# Altium schematic sheet JTAG_Connector.SchDoc
size A4; Author: Nguyễn Hữu Thắng; DrawnBy: Nguyễn Hữu Thắng; SheetNumber: 27; SheetTotal: 36
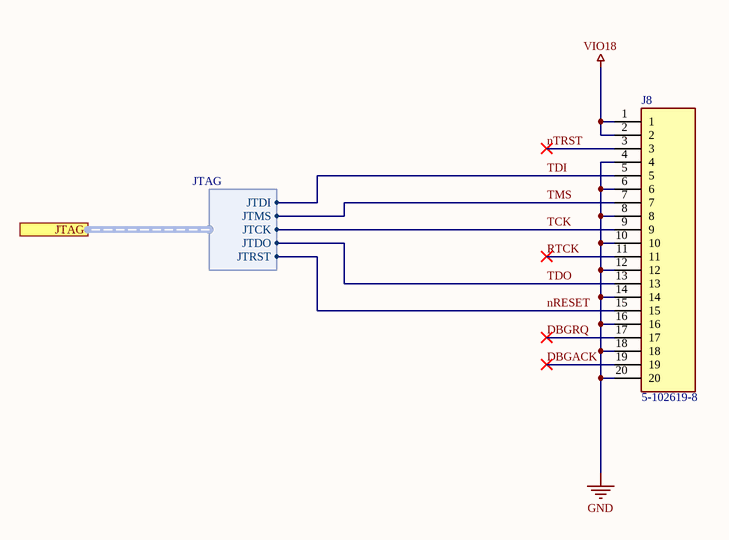
[diagram p0: JTAG_Connector.SchDoc]

## Parts
J8  5-102619-8  [TE_5-102619-8]

## Ports
JTAG (harness JTAG, see main[9000,6700], MT8365[11000,4200], MT8365_Other[1500,1700])

## Harnesses
JTAG: JTCK, JTDI, JTDO, JTMS, JTRST

## Nets
GND: J8.4 J8.6 J8.8 J8.10 J8.12 J8.14 J8.16 J8.18 J8.20
VIO18: J8.1 J8.2
DBGACK: J8.19
DBGRQ: J8.17
nRESET: J8.15 ; port JTAG.JTRST
nTRST: J8.3
RTCK: J8.11
TCK: J8.9 ; port JTAG.JTCK
TDI: J8.5 ; port JTAG.JTDI
TDO: J8.13 ; port JTAG.JTDO
TMS: J8.7 ; port JTAG.JTMS

## Library data of the parts
J8 = 5-102619-8: Conn Shrouded Header HDR 20 POS 2.54mm Solder ST Thru-Hole Tray